# EAGLE schematic ElectronicSpeedRegulator (EAGLE 7.5.0)
AVR8 - Electronic Speed Regulator
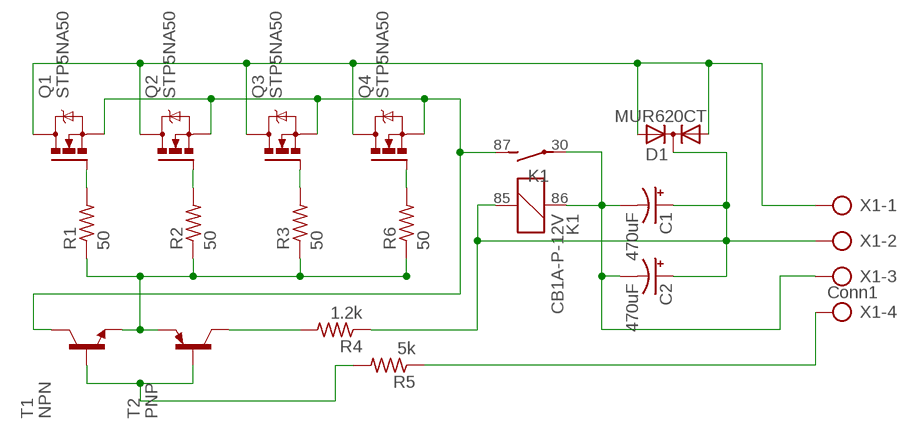
[diagram p0: schematic, sheet 1]

## Parts
C1  470uF  CPOL-USE5-13  [E5-13]
C2  470uF  CPOL-USE5-13  [E5-13]
D1  MUR620CT  [TO220AB]
K1  CB1A-P-12V  [CB1]
Q1  STP5NA50  [TO220BV]
Q2  STP5NA50  [TO220BV]
Q3  STP5NA50  [TO220BV]
Q4  STP5NA50  [TO220BV]
R1  50  R-US_0204/7  [0204/7]
R2  50  R-US_0204/7  [0204/7]
R3  50  R-US_0204/7  [0204/7]
R4  1.2k  R-US_0204/7  [0204/7]
R5  5k  R-US_0204/7  [0204/7]
R6  50  R-US_0204/7  [0204/7]
T1  NPN  -NPN-TO92-EBC  [TO92-EBC]
T2  PNP  BC327-16-PNP-TO92-EBC  [TO92-EBC]
X1  Conn1  AK300/4  [AK300/4]

## Nets
GND: C1.- C2.- K1.30(2:P) K1.86 X1.3
GND_RELAY: K1.87(2:S) Q1.S Q2.S Q3.S Q4.S T1.C
MCU_PWM_SIGNAL_PNP_NPN_BASE: R5.2 T1.B T2.B
MOSFET_DRIVER_SWITCH: R1.1 R2.1 R3.1 R6.1 T1.E T2.E
MOTOR_DRIVER_V-: D1.A1 D1.A2 Q1.D Q2.D Q3.D Q4.D X1.1
N$1: Q1.G R1.2
N$2: Q2.G R2.2
N$3: Q3.G R3.2
N$4: Q4.G R6.2
N$5: R5.1 X1.4
PNP_V+: R4.2 T2.C
V+: C1.+ C2.+ D1.C K1.85 R4.1 X1.2

## Library data of the parts
C1 C2 = adafruit:CPOL-US: POLARIZED CAPACITOR, American symbol
D1 = diode:MUR620CT: DIODE dual rectifier, 6 A, 200 V, common cathode
K1 = relay:CB*: HIGH POWER AUTOMOTIVE RELAY Form A NAiS Source: http://www.mew-europe.com/.. en_ds_61202_0000.pdf; MF: AROMAT/ MATSUSHITA; MPN: CB1A-P-12V; OC_FARNELL: 1270582; OC_NEWARK: 50B849
Q1-Q4 = transistor-power:STP5NA50: N-CHANNEL MOS FET
R1-R6 = adafruit:R-US_: RESISTOR, American symbol
T1 = transistor:*-NPN-: NPN Transistror BF959 corrected 2008.03.06
T2 = transistor:*-PNP-: PNP Transistror
X1 = con-ptr500:AK300/4: CONNECTOR; OC_FARNELL: unknown; OC_NEWARK: unknown